# EAGLE design CAN_Logger (EAGLE 6.4)
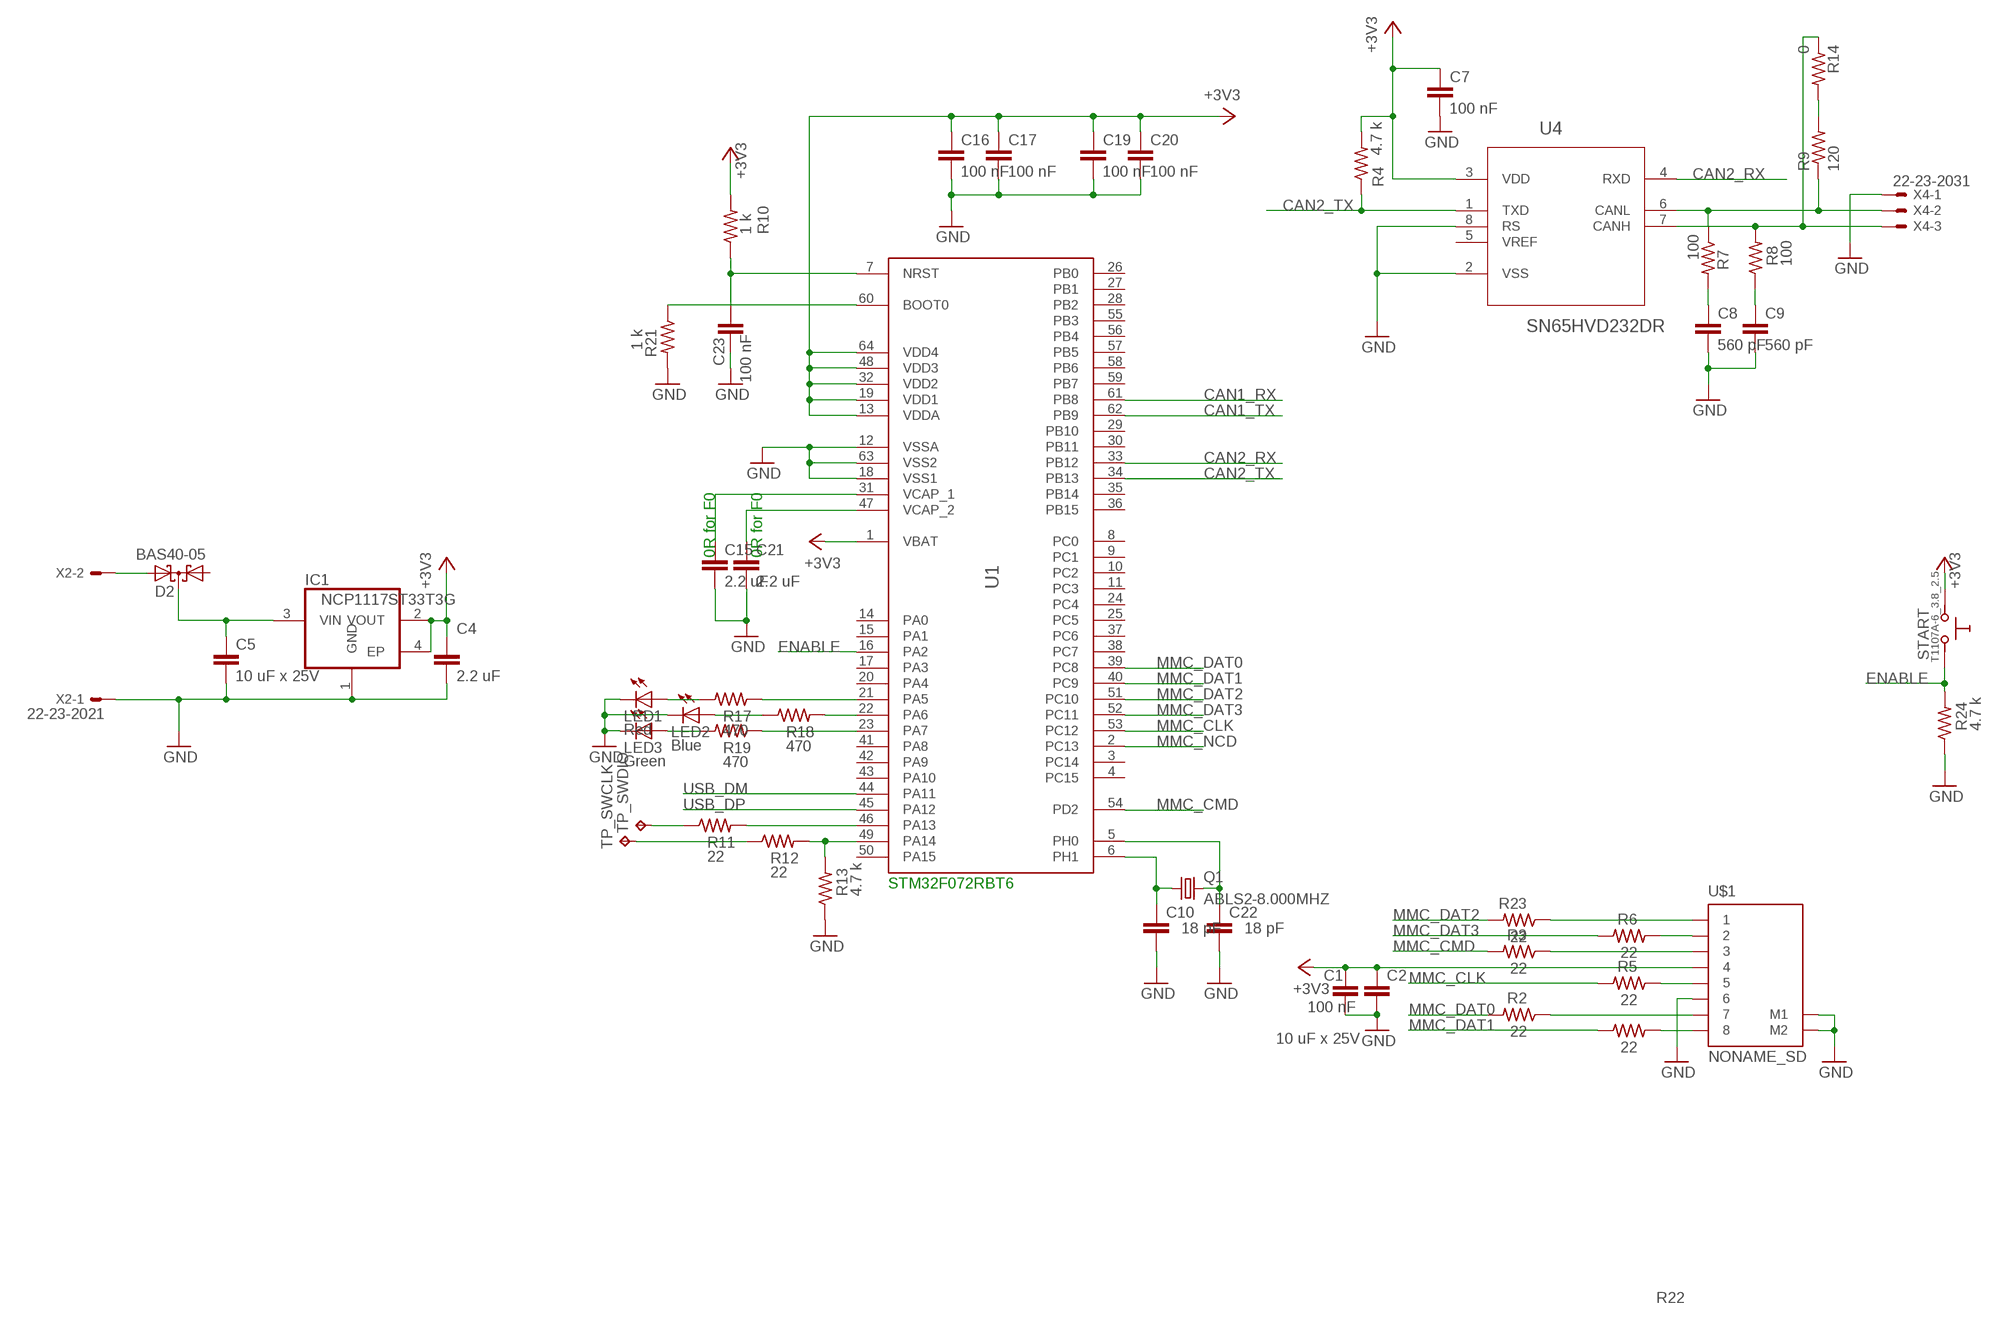
[diagram p0: schematic, sheet 1]

## Parts
C1  100 nF  C-EUC0603  [C0603]
C2  10 uF x 25V  C-EUC1206  [C1206]
C4  2.2 uF  C-EUC0603  [C0603]
C5  10 uF x 25V  C-EUC1206  [C1206]
C7  100 nF  C-EUC0603  [C0603]
C8  560 pF  C-EUC0603  [C0603]
C9  560 pF  C-EUC0603  [C0603]
C10  18 pF  C-EUC0603  [C0603]
C15  2.2 uF  C-EUC0603  [C0603]
C16  100 nF  C-EUC0603  [C0603]
C17  100 nF  C-EUC0603  [C0603]
C19  100 nF  C-EUC0603  [C0603]
C20  100 nF  C-EUC0603  [C0603]
C21  2.2 uF  C-EUC0603  [C0603]
C22  18 pF  C-EUC0603  [C0603]
C23  100 nF  C-EUC0603  [C0603]
D2  BAS40-05  [SOT23]
IC1  NCP1117ST33T3G  REG1117  [SOT223]
LED1  Red  LED_ESML0603  [LED_SML0603]
LED2  Blue  LED_ESML0603  [LED_SML0603]
LED3  Green  LED_ESML0603  [LED_SML0603]
Q1  ABLS2-8.000MHZ  CRYSTALSM49  [SM49]
R2  22  R-US_R0603  [R0603]
R3  22  R-US_R0603  [R0603]
R4  4.7 k  R-US_R0603  [R0603]
R5  22  R-US_R0603  [R0603]
R6  22  R-US_R0603  [R0603]
R7  100  R-US_R0603  [R0603]
R8  100  R-US_R0603  [R0603]
R9  120  R-US_R0805  [R0805]
R10  1 k  R-US_R0603  [R0603]
R11  22  R-US_R0603  [R0603]
R12  22  R-US_R0603  [R0603]
R13  4.7 k  R-US_R0603  [R0603]
R14  0  R-US_R0402  [R0402]
R17  470  R-US_R0603  [R0603]
R18  470  R-US_R0603  [R0603]
R19  470  R-US_R0603  [R0603]
R21  1 k  R-US_R0603  [R0603]
R22  22  R-US_R0603  [R0603]
R23  22  R-US_R0603  [R0603]
R24  4.7 k  R-US_R0603  [R0603]
START  T1107A-6_3.8_2.5  SW-TAKT6  [SW-TAKT_6X3.5_SMD]
TP_SWCLK  TPTP10SQ  [TP10SQ]
TP_SWDIO  TPTP10SQ  [TP10SQ]
U1  STM32F405RGT6  STM32F405XXSTM32F405XX  [LQFP64]
U4  SN65HVD232DR  MCP2551-E/SN  [SOIC127P600X175-8N]
U$1  NONAME_SD  [NONAME_SD]
X2  22-23-2021  [22-23-2021]
X4  22-23-2031  [22-23-2031]

## Nets
+3V3: C1.1 C2.1 C4.1 C7.1 C16.1 C17.1 C19.1 C20.1 IC1.2(VOUT) IC1.4(EP) R4.2 R10.2 START.P$1 U1.1(VBAT) U1.13(VDDA) U1.19(VDD1) U1.32(VDD2) U1.48(VDD3) U1.64(VDD4) U4.3(VDD) U$1.4
CAN1_RX: U1.61(PB8)
CAN1_TX: U1.62(PB9)
CAN2_RX: U1.33(PB12) U4.4(RXD)
CAN2_TX: R4.1 U1.34(PB13) U4.1(TXD)
ENABLE: R24.2 START.P$2 U1.16(PA2)
GND: C1.2 C2.2 C4.2 C5.2 C7.2 C8.2 C9.2 C10.2 C15.2 C16.2 C17.2 C19.2 C20.2 C21.2 C22.2 C23.2 IC1.1(GND) LED1.C LED2.C LED3.C R13.1 R21.2 R24.1 U1.12(VSSA) U1.18(VSS1) U1.63(VSS2) U4.2(VSS) U4.8(RS) U$1.6 U$1.M1 U$1.M2 X2.1 X4.1
MMC_CLK: R5.2 U1.53(PC12)
MMC_CMD: R3.2 U1.54(PD2)
MMC_DAT0: R2.2 U1.39(PC8)
MMC_DAT1: R22.2 U1.40(PC9)
MMC_DAT2: R23.2 U1.51(PC10)
MMC_DAT3: R6.2 U1.52(PC11)
MMC_NCD: U1.2(PC13)
N$1: C15.1 U1.31(VCAP_1)
N$2: D2.2(A2) X2.2
N$4: R3.1 U$1.3
N$5: R2.1 U$1.7
N$6: R5.1 U$1.5
N$7: R17.2 U1.21(PA5)
N$8: R7.1 R9.1 U4.6(CANL) X4.2
N$9: C5.1 D2.3(C) IC1.3(VIN)
N$10: R8.2 R14.1 U4.7(CANH) X4.3
N$11: R6.1 U$1.2
N$12: C8.1 R7.2
N$13: C9.1 R8.1
N$14: R18.2 U1.22(PA6)
N$15: R19.2 U1.23(PA7)
N$16: LED1.A R17.1
N$17: LED2.A R18.1
N$18: LED3.A R19.1
N$19: R22.1 U$1.8
N$20: R23.1 U$1.1
N$21: R11.2 U1.46(PA13)
N$22: R12.2 R13.2 U1.49(PA14)
N$23: C21.1 U1.47(VCAP_2)
N$24: R11.1 TP_SWDIO.TP
N$25: R12.1 TP_SWCLK.TP
N$27: C23.1 R10.1 U1.7(NRST)
N$28: R21.1 U1.60(BOOT0)
N$29: R9.2 R14.2
N$34: C22.1 Q1.2 U1.5(PH0)
N$35: C10.1 Q1.1 U1.6(PH1)
USB_DM: U1.44(PA11)
USB_DP: U1.45(PA12)
Unconnected: D2.1(A1) U1.3(PC14) U1.4(PC15) U1.8(PC0) U1.9(PC1) U1.10(PC2) U1.11(PC3) U1.14(PA0) U1.15(PA1) U1.17(PA3) U1.20(PA4) U1.24(PC4) U1.25(PC5) U1.26(PB0) U1.27(PB1) U1.28(PB2) U1.29(PB10) U1.30(PB11) U1.35(PB14) U1.36(PB15) U1.37(PC6) U1.38(PC7) U1.41(PA8) U1.42(PA9) U1.43(PA10) U1.50(PA15) U1.55(PB3) U1.56(PB4) U1.57(PB5) U1.58(PB6) U1.59(PB7) U4.5(VREF)

## Notes on the sheet
- 0R for F0 | 0R for F0
- STM32F072RBT6

## Library data of the parts
C1 C2 C4 C5 C7-C10 C15-C17 C19-C23 = rcl:C-EU: CAPACITOR, European symbol
D2 = diode:BAS40-05: Silicon Schottky Diodes General-purpose diode for high-speed switching
IC1 = burr-brown:REG1117: 800mA and 1A Low Dropout (LDO) Positive Regulator 1.8V, 2.5V, 2.85V, 3.3V, 5V, and Adj; MPN: REG1117; OC_FARNELL: 1097566; OC_NEWARK: 14P6981
LED1-LED3 = eagle-ltspice:LED_E: LED Source: http://www.osram.convergy.de Source: www.luxeon.com Source: www.kingbright.com; SPICEMODEL: NONE; SPICEPREFIX: D; SPICETYPE: diode
Q1 = adafruit:CRYSTAL: CRYSTAL; OC_FARNELL: unknown; OC_NEWARK: unknown
R2-R8 R10-R13 R17-R19 R21-R24 = resistor:R-US_: RESISTOR, American symbol
R9 R14 = rcl:R-US_: RESISTOR, American symbol
START = gogo:SW-TAKT
TP_SWCLK TP_SWDIO = testpad:TP: Test pad
U1 = stm32f:STM32F405XX: Features • Core: ARM 32-bit Cortex™-M4 CPU with FPU, Adaptive real-time accelerator (ART Accelerator™) allowing 0-wait state execution from Flash memory, frequency up to 168 MHz, memory protection unit, 210 DMIPS/ 1.25 DMIPS/MHz (Dhrystone 2.1), and DSP instructions • Memories – Up to 1 Mbyte of Flash memory – Up to 192+4 Kbytes of SRAM including 64- Kbyte of CCM (core coupled memory) data RAM – Flexible static memory controller supporting Compact Flash, SRAM, PSRAM, NOR and NAND memories • LCD parallel interface, 8080/6800 modes • Clock, reset and supply management – 1.8 V to 3.6 V application supply and I/Os – POR, PDR, PVD and BOR – 4-to-26 MHz crystal oscillator – Internal 16 MHz factory-trimmed RC (1% accuracy) – 32 kHz oscillator for RTC with calibration – Internal 32 kHz RC with calibration • Low power – Sleep, Stop and Standby modes – VBAT supply for RTC, 20×32 bit backup registers + optional 4 KB backup SRAM • 3×12-bit, 2.4 MSPS A/D converters: up to 24 channels and 7.2 MSPS in triple interleaved mode • 2×12-bit D/A converters • General-purpose DMA: 16-stream DMA controller with FIFOs and burst support • Up to 17 timers: up to twelve 16-bit and two 32- bit timers up to 168 MHz, each with up to 4 IC/OC/PWM or pulse counter and quadrature (incremental) encoder input • Debug mode – Serial wire debug (SWD) & JTAG interfaces – Cortex-M4 Embedded Trace Macrocell™ • Up to 140 I/O ports with interrupt capability – Up to 136 fast I/Os up to 84 MHz – Up to 138 5 V-tolerant I/Os • Up to 15 communication interfaces – Up to 3 × I2C interfaces (SMBus/PMBus) – Up to 4 USARTs/2 UARTs (10.5 Mbit/s, ISO 7816 interface, LIN, IrDA, modem control) – Up to 3 SPIs (42 Mbits/s), 2 with muxed full-duplex I2S to achieve audio class accuracy via internal audio PLL or external clock – 2 × CAN interfaces (2.0B Active) – SDIO interface • Advanced connectivity – USB 2.0 full-speed device/host/OTG controller with on-chip PHY – USB 2.0 high-speed/full-speed device/host/OTG controller with dedicated DMA, on-chip full-speed PHY and ULPI – 10/100 Ethernet MAC with dedicated DMA: supports IEEE 1588v2 hardware, MII/RMII • 8- to 14-bit parallel camera interface up to 54 Mbytes/s • True random number generator • CRC calculation unit • 96-bit unique ID • RTC: subsecond accuracy, hardware calendar
U4 = MCP2551-E_SN:MCP2551-E/SN: High-Speed CAN Transceiver; DESCRIPTION: High-Speed CAN Transceiver; MPN: MCP2551-E/SN; OC_FARNELL: 1467746; OC_NEWARK: 92C4186; PACKAGE: SOIC-8; SUPPLIER: Microchip
U$1 = uSD:NONAME_SD
X2 = con-molex:22-23-2021: .100" (2.54mm) Center Header - 2 Pin; MF: MOLEX; MPN: 22-23-2021; OC_FARNELL: 1462926; OC_NEWARK: 25C3832
X4 = con-molex:22-23-2031: .100" (2.54mm) Center Header - 3 Pin; MF: MOLEX; MPN: 22-23-2031; OC_FARNELL: 1462950; OC_NEWARK: 30C0862

## Net classes
1 PWR: width 0.203 mm, drill 0.4 mm, clearance 0.076 mm

## Board
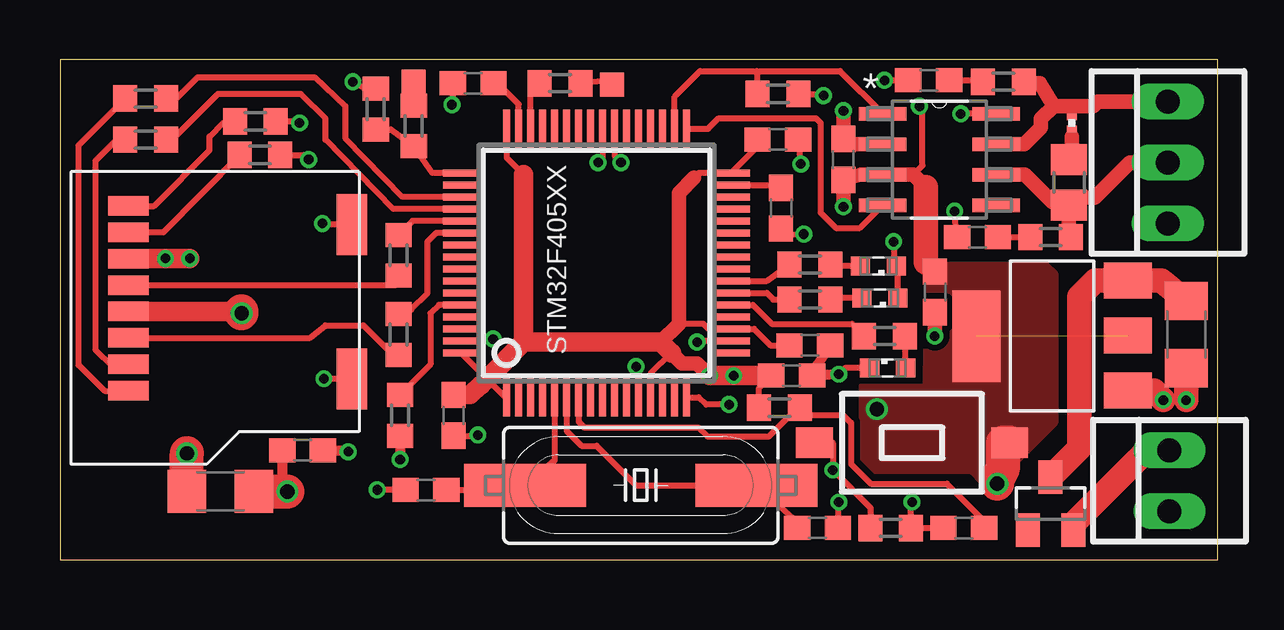
[diagram p1: board, top side]
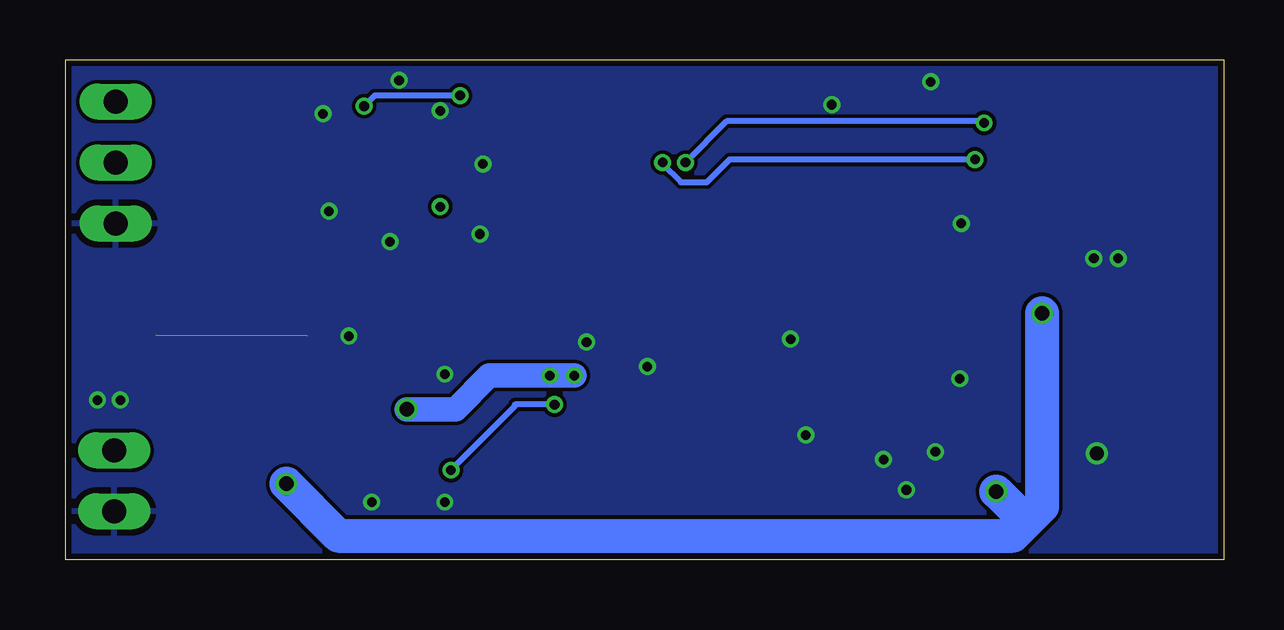
[diagram p2: board, bottom side, seen from below]

Size 48.26 x 20.85 mm. Coordinates in mm from the lower left corner, seen from the top.
Outline: 0,0 48.26,0 48.26,20.85 0,20.85 0,0
Copper layers (1*16): Top 0.035mm / dielectric 1.5mm / Bottom 0.035mm
Design rules "dirt_cheap_dirty_boards.v1 *": minimum track width 5mil, minimum drill 12mil, track to track 6mil, track to pad 6mil, pad to pad 6mil, via to via 6mil, smd to smd 1mil, copper to edge 10mil, drill to drill 10mil, minimum pad ring 10mil, minimum via ring 6mil, stop-mask expansion 2mil, vias tented up to drill 25mil, thermal gap 10mil

### Footprints (pad centres in the part's own frame; a part is rotated, then mirrored left to right if it is on the bottom)
C0603 = smd 1.1 x 1: 1 -0.85,0; 2 0.85,0
C1206 = smd 1.6 x 1.8: 1 -1.4,0; 2 1.4,0
SOT23 = smd 1 x 1.4: 1 -0.95,-1.1; 2 0.95,-1.1; 3 0,1.1
SOT223 = smd 1.499 x 2.007: 1 -2.261,-3.15; 2 0.025,-3.15; 3 2.311,-3.15 | smd 3.81 x 2.007: 4 0,3.15
LED_SML0603 = smd 0.8 x 0.8: A 0.75,0; C -0.75,0
SM49 = smd 5.08 x 1.778: 1 -4.826,0; 2 4.826,0
R0603 = smd 1 x 1.1: 1 -0.85,0; 2 0.85,0
R0805 = smd 1.3 x 1.5: 1 -0.95,0; 2 0.95,0
R0201 = smd 0.28 x 0.43: 1 -0.255,0; 2 0.255,0
SW-TAKT_6X3.5_SMD = smd 1.27 x 1.524: P$1 0,4.064; P$2 0,-4.064
TP10SQ = smd 1 x 1: TP 0,0
LQFP64 = smd 1.6 x 0.3: 1 -5.6,3.75; 2 -5.6,3.25; 3 -5.6,2.75; 4 -5.6,2.25; 5 -5.6,1.75; 6 -5.6,1.25; 7 -5.6,0.75; 8 -5.6,0.25; 9 -5.6,-0.25; 10 -5.6,-0.75; 11 -5.6,-1.25; 12 -5.6,-1.75; 13 -5.6,-2.25; 14 -5.6,-2.75; 15 -5.6,-3.25; 16 -5.6,-3.75; 33 5.6,-3.75; 34 5.6,-3.25; 35 5.6,-2.75; 36 5.6,-2.25; 37 5.6,-1.75; 38 5.6,-1.25; 39 5.6,-0.75; 40 5.6,-0.25; 41 5.6,0.25; 42 5.6,0.75; 43 5.6,1.25; 44 5.6,1.75; 45 5.6,2.25; 46 5.6,2.75; 47 5.6,3.25; 48 5.6,3.75 | smd 0.3 x 1.6: 17 -3.75,-5.6; 18 -3.25,-5.6; 19 -2.75,-5.6; 20 -2.25,-5.6; 21 -1.75,-5.6; 22 -1.25,-5.6; 23 -0.75,-5.6; 24 -0.25,-5.6; 25 0.25,-5.6; 26 0.75,-5.6; 27 1.25,-5.6; 28 1.75,-5.6; 29 2.25,-5.6; 30 2.75,-5.6; 31 3.25,-5.6; 32 3.75,-5.6; 49 3.75,5.6; 50 3.25,5.6; 51 2.75,5.6; 52 2.25,5.6; 53 1.75,5.6; 54 1.25,5.6; 55 0.75,5.6; 56 0.25,5.6; 57 -0.25,5.6; 58 -0.75,5.6; 59 -1.25,5.6; 60 -1.75,5.6; 61 -2.25,5.6; 62 -2.75,5.6; 63 -3.25,5.6; 64 -3.75,5.6
SOIC127P600X175-8N = smd 1.981 x 0.559: 1 -2.362,1.905; 2 -2.362,0.635; 3 -2.362,-0.635; 4 -2.362,-1.905; 5 2.362,-1.905; 6 2.362,-0.635; 7 2.362,0.635; 8 2.362,1.905
NONAME_SD = smd 1.676 x 0.813: 1 9.61,9.13; 2 9.61,8.03; 3 9.61,6.93; 4 9.61,5.83; 5 9.61,4.73; 6 9.61,3.63; 7 9.61,2.53; 8 9.61,1.43 | smd 1.27 x 2.54: M1 0.3,8.65; M2 0.3,2.2
22-23-2021 = drill 1 long: 1 -1.27,0; 2 1.27,0
22-23-2031 = drill 1 long: 1 -2.54,0; 2 0,0; 3 2.54,0

### Placement (x,y rotation side)
C1  10.11,4.57 0 top
C2  6.68,2.86 180 top
C4  36.47,11.18 270 top
C5  46.94,9.4 270 top
C7  32.66,16.7 90 top
C8  38.24,13.46 180 top
C9  36.21,20 180 top
C10  31.58,1.33 0 top
C15  30.05,14.67 270 top
C16  29.92,17.53 0 top
C17  31.26,8.95 0 top
C19  30.5,7.68 0 top
C20  16.4,6.03 270 top
C21  17.22,19.88 180 top
C22  15.26,2.92 180 top
C23  37.67,1.33 180 top
D2  41.29,2.35 0 top
IC1  41.35,9.33 90 top
LED1  34.5,8 0 top
LED2  34.18,10.92 180 top
LED3  34.12,12.26 180 top
Q1  24.21,3.11 180 top
R2  8.33,16.89 0 top
R3  14.11,9.4 90 top
R4  29.92,19.43 0 top
R5  14.11,12.7 90 top
R6  3.57,17.53 0 top
R7  41.29,13.46 180 top
R8  39.32,19.94 0 top
R9  42.05,15.75 90 top
R10  29.99,6.35 180 top
R11  20.84,19.88 180 top
R12  14.75,18.1 270 top
R13  13.16,18.8 270 top
R14  0  [R0201]  42.18,18.22 270 top
R17  34.37,9.33 180 top
R18  31.26,10.86 180 top
R19  31.26,12.32 180 top
R21  14.18,6.03 270 top
R22  8.14,18.29 0 top
R23  3.57,19.24 0 top
R24  34.62,1.33 180 top
START  35.51,4.89 270 top
TP_SWCLK  14.75,19.94 0 top
TP_SWDIO  23,19.81 0 top
U1  22.37,12.38 90 top
U4  36.66,16.7 0 top
U$1  12.46,16.19 180 top
X2  46.24,3.3 90 top
X4  46.18,16.57 90 top

### Tracks (layer width: path | path; a pad name or v marks a point on that pad's centre or on a via)
+3V3  (via drill 0.4, 0.6)  (1 unrouted)
  Top 0.254: U1.13 24.62,7.77 25.48,8.64 | U1.32 28,16.16 28.56,16.16 | U1.32 26.63,16.13 26.43,15.94 | 25.8,9.97 25.8,9.84 26.81,9.84 27.02,9.63 U1.19 28.93,9.63 29.61,8.95 C17.1 | U1.1 18.57,6.78 17.8,7.56 16.77,8.58 U1.64 | C16.1 29.14,17.3 U1.32 | U1.48 18.62,16.77 19.32,16.07 | R10.2 29.14,7.18 C19.1 | R4.2 31.77,19.43 v31.83,19.37 | v35.83,18.92 35.96,18.8 35.96,16.45 35.58,16.07
  Top 0.406: C1.1 9.26,3.07 v9.48,2.86
  Top 0.61: v27.07,7.68 26.56,8.19 25.92,8.19 25.48,8.64 | 25.8,9.84 25.04,9.08 | 26.43,15.94 25.8,15.3 25.8,9.97 | v32.66,14.73 C7.1 33.38,16.07 U4.3 35.58,16.07 36.08,15.56 | 36.08,12.41 C4.1
  Top 0.813: C19.1 v28.08,7.68 v27.07,7.68 | 25.48,8.64 25.04,9.08 19.32,9.08 | 19.32,9.08 17.8,7.56 17.54,7.3 17.1,6.9 C20.1 | 19.32,9.08 19.32,16.07 | U$1.4 7.57,10.36
  Top 1.016: 36.08,15.56 36.08,12.41
  Top 1.422: v39.07,3.17 39.01,3.24 39.32,3.87 39.32,4.89 START.P$1 | v7.57,10.29 7.57,10.36 | C2.1 v9.48,2.86
  Bottom 0.254: v35.83,18.92 35.38,19.37 v31.83,19.37
  Bottom 1.016: v27.07,7.68 30.62,7.68 32.02,6.29 v34.05,6.29
  Bottom 1.422: v39.07,3.17 36.91,1.02 8.78,1.02 8.21,1.59 | v7.57,10.29 7.57,2.22 8.21,1.59 | v9.48,2.86 8.21,1.59
  pour Top (isolate 0.254, no thermals): 41.48,11.94 41.48,5.71 39.01,3.24 38.43,3.24 37.99,3.68 33.99,3.68 33.42,4.25 33.42,7.24 36.08,7.24 36.08,7.43 36.15,11.49 36.15,12.32 41.1,12.32
CAN2_RX
  Top 0.254: U1.33 27.02,17.98 27.45,18.42 31.51,18.42 31.7,18.22 31.7,14.48 32.34,13.84 33.34,13.84 U4.4
CAN2_TX
  Top 0.254: U1.34 25.62,19.32 26.69,20.38 29.04,20.38 | 29.04,20.38 32.52,20.38 U4.1 | R4.1 29.07,20.34 29.04,20.38
ENABLE  (via drill 0.4)
  Top 0.254: U1.16 26.64,6.78 26.94,6.48 v27.89,6.48 | R24.2 33.8,1.36 33.8,2.16 v32.21,3.75 32.21,4.89 START.P$2
  Bottom 0.254: v27.89,6.48 29.54,6.48 29.54,6.41 v32.21,3.75
GND  (via drill 0.4, 0.6)
  Top 0.254: C8.2 v37.29,14.54 | 32.93,17.34 C7.2 | U1.18 26.61,9.13 v26.56,9.08 | U1.12 24.12,8.09 v24.02,8.06 | U1.63 18,9.13 v18.05,9.21 | C22.2 v13.22,2.92 | C20.2 17.38,5.18 v17.42,5.21 | C10.2 v32.46,2.41 | v34.37,20 C9.2 | 31.41,7.9 v32.46,7.75 32.72,8 LED1.C | U4.8 v37.54,18.61 | R13.1 12.69,19.65 v12.21,19.94 | C15.2 29.67,13.53 v31,13.59 | C16.2 30.84,16.73 v30.88,16.51 | LED2.C 34.93,12.19 LED3.C | C23.2 R24.1 35.47,2.37 v35.51,2.41 | C21.2 16.38,19.03 v16.34,18.99 | v34.75,13.27 34.75,12.37 LED3.C | 35.07,12.05 LED3.C | U$1.M1 11.02,7.54 v11,7.56 | U$1.M2 10.98,13.99 v10.94,14.03
  Top 0.406: C19.2 v32.46,7.75 | C17.2 31.41,7.9 | C1.2 11.95,4.57 v12.02,4.51 | R21.2 v14.18,4.19
  Top 0.61: C7.2 v32.66,18.73 | U4.2 32.93,17.34 | C4.2 v36.47,9.33
  Top 0.813: U$1.6 5.4,12.56 v5.41,12.57
  Top 1.016: C5.2 v46.94,6.67 | IC1.1 45.58,7.07 v45.99,6.67
  Top 1.422: C2.2 v5.29,4.44
  other vias: 4.4,12.57
  pour Bottom: 0.14,0.19 0.14,20.64 48.02,20.64 48.02,0.19
MMC_CLK
  Top 0.254: U1.53 14.69,14.13 R5.2
MMC_CMD
  Top 0.254: R3.2 14.65,10.44 15.32,11.11 15.32,13.27 15.68,13.63 U1.54
MMC_DAT0  (via drill 0.4)
  Top 0.254: U1.39 23.12,16.84 v23.38,16.57 | R2.2 10.18,16.89 v10.37,16.7
  Bottom 0.254: v10.37,16.7 20.59,16.7 21.54,15.75 22.62,15.75 23.38,16.51 v23.38,16.57
MMC_DAT1  (via drill 0.4)
  Top 0.254: U1.40 22.62,16.76 v22.43,16.57 | R22.2 9.86,18.29 9.92,18.22 v9.99,18.22
  Bottom 0.254: v22.43,16.57 20.72,18.29 10.05,18.29 v9.99,18.22
MMC_DAT2
  Top 0.254: U1.51 14.28,15.13 11.89,17.59 11.89,18.92 10.62,20.13 5.73,20.13 4.84,19.24 R23.2
MMC_DAT3
  Top 0.254: U1.52 13.89,14.63 11.06,17.53 11.06,18.42 10.05,19.43 6.58,19.43 4.68,17.53 R6.2
N$1
  Top 0.254: U1.31 29.67,15.63 C15.1
N$2
  Top 1.016: X2.2 45.31,4.57 42.24,1.5 D2.2
N$4
  Top 0.254: U$1.3 10.42,9.26 11.06,9.78 12.65,9.78 13.88,8.55 R3.1
N$5
  Top 0.254: U$1.7 4.32,13.66 R2.1
N$6
  Top 0.254: U$1.5 13.98,11.46 R5.1
N$7
  Top 0.254: U1.21 28.88,10.63 29.67,9.84 33.01,9.84 R17.2
N$8
  Top 0.61: X4.2 44.59,16.57 43.13,15.11 41.74,15.11 41.55,14.92 | U4.6 40.21,16.07 41.36,14.92 41.55,14.92 | 41.55,14.92 42.05,14.92 R9.1 42.05,13.53 R7.1
N$9
  Top 1.016: D2.3 42.5,4.66 42.5,10.99 43.16,11.65 IC1.3 45.9,11.65 C5.1
N$10
  Top 0.254: R14.1 42.18,18.8
  Top 0.406: 42.18,18.8 42.18,18.86 42.24,18.92
  Top 0.61: R8.2 40.24,19.88 40.85,19.88 41.42,18.92 | U4.7 40.2,17.34 40.9,18.03 40.9,18.4 41.42,18.92 | 41.42,18.92 42.24,18.92 43.07,18.92 43.26,19.11 X4.3
N$11
  Top 0.254: R6.1 2.37,17.53 1.48,16.64 1.48,8.76 2.17,8.06 2.75,8.06 U$1.2
N$12
  Top 0.254: C8.1 R7.2
N$13
  Top 0.254: C9.1 38.41,20
  Top 0.61: 38.41,20 R8.1
N$14
  Top 0.254: U1.22 29.46,11.13 29.73,10.86 R18.2
N$15
  Top 0.254: U1.23 29.47,11.63 R19.2
N$16
  Top 0.254: LED1.A 35.25,9.31 R17.1
N$17
  Top 0.254: 32.27,10.6 R18.1 32.17,10.92 LED2.A
N$18
  Top 0.254: 32.34,12 32.15,12 R19.1 32.17,12.26 LED3.A
N$19
  Top 0.254: U$1.8 3.92,14.76 6.24,17.08 6.24,17.65 6.81,18.22 7.49,18.22 R22.1
N$20
  Top 0.254: 2.68,19.24 R23.1 0.78,17.3 0.78,8.13 1.86,7.05 2.84,7.05 U$1.1
N$21
  Top 0.254: U1.46 19.62,19.7 R11.2
N$22
  Top 0.254: U1.49 15.53,16.13 R12.2 13.79,17.95 R13.2
N$23
  Top 0.254: U1.47 19.12,19 18.56,19.56 18.39,19.56 C21.1
N$24
  Top 0.254: TP_SWDIO.TP 22.62,19.96 R11.1
N$25
  Top 0.254: R12.1 TP_SWCLK.TP
N$27
  Top 0.254: U1.7 21.62,5.77 21.86,5.52 26.62,5.52 27,5.14 29.54,5.14 30.56,6.16 30.66,6.06 30.84,6.06 | C23.1 38.56,1.37 38.56,1.59 36.97,3.17 33.8,3.17 32.97,4 32.97,5.72 32.63,6.06 30.84,6.06 | R10.1 30.84,6.06
N$28
  Top 0.254: U1.60 15.79,10.63 15.45,10.29 15.45,8.15 R21.1
N$29
  Top 0.254: R14.2 42.18,17.65
  Top 0.61: 42.2,16.84 R9.2 42.18,16.83 42.18,17.65
N$34
  Top 0.254: U1.5 20.62,4.16 Q1.2 17.42,2.92 C22.1
N$35
  Top 0.254: U1.6 21.12,5.38 21.73,4.76 22.37,4.76 24.02,3.11 Q1.1 | Q1.1 29.23,3.15 | C10.1 31,1.33 Q1.1